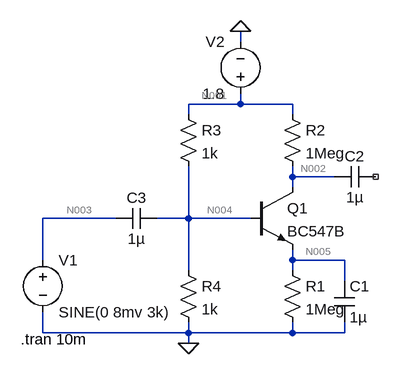
[diagram p0: schematic initial-1-0-1.asc]
initial-1-0-1.asc, the LTspice schematic file:
Version 4
SHEET 1 880 680
WIRE 96 -144 96 -160
WIRE 96 -48 96 -64
WIRE 96 -48 16 -48
WIRE 176 -48 96 -48
WIRE 16 -32 16 -48
WIRE 176 -32 176 -48
WIRE 176 64 176 48
WIRE 240 64 176 64
WIRE 176 80 176 64
WIRE -96 128 -208 128
WIRE 16 128 16 48
WIRE 16 128 -32 128
WIRE 112 128 16 128
WIRE -208 192 -208 128
WIRE 176 192 176 176
WIRE 256 192 176 192
WIRE 16 208 16 128
WIRE 176 208 176 192
WIRE 256 224 256 192
WIRE -208 304 -208 272
WIRE 16 304 16 288
WIRE 16 304 -208 304
WIRE 176 304 176 288
WIRE 176 304 16 304
WIRE 256 304 256 288
WIRE 256 304 176 304
WIRE 16 320 16 304
FLAG 16 320 0
FLAG 96 -160 0
SYMBOL npn 112 80 R0
SYMATTR InstName Q1
SYMATTR Value BC547B
SYMBOL res 160 192 R0
SYMATTR InstName R1
SYMATTR Value 1Meg
SYMBOL res 160 -48 R0
SYMATTR InstName R2
SYMATTR Value 1Meg
SYMBOL res 0 -48 R0
SYMATTR InstName R3
SYMATTR Value 1k
SYMBOL res 0 192 R0
SYMATTR InstName R4
SYMATTR Value 1k
SYMBOL cap 240 224 R0
SYMATTR InstName C1
SYMATTR Value 1µ
SYMBOL cap 304 48 R90
WINDOW 0 0 32 VBottom 2
WINDOW 3 32 32 VTop 2
SYMATTR InstName C2
SYMATTR Value 1µ
SYMBOL cap -32 112 R90
WINDOW 0 0 32 VBottom 2
WINDOW 3 32 32 VTop 2
SYMATTR InstName C3
SYMATTR Value 1µ
SYMBOL voltage -208 176 R0
WINDOW 123 0 0 Left 0
WINDOW 39 0 0 Left 0
SYMATTR InstName V1
SYMATTR Value SINE(0 8mv 3k)
SYMBOL voltage 96 -48 R180
WINDOW 0 24 96 Left 2
WINDOW 3 24 16 Left 2
WINDOW 123 0 0 Left 0
WINDOW 39 0 0 Left 0
SYMATTR InstName V2
SYMATTR Value 1.8
TEXT -242 314 Left 2 !.tran 10m

The netlist it stands for:
* initial-1-0-1.asc
Q1 N002 N004 N005 0 BC547B
R1 N005 0 1Meg
R2 N001 N002 1Meg
R3 N001 N004 1k
R4 N004 0 1k
C1 N005 0 1µ
C2 NC_01 N002 1µ
C3 N004 N003 1µ
V1 N003 0 SINE(0 8mv 3k)
V2 N001 0 1.8
.model NPN NPN
.model PNP PNP
.lib standard.bjt
.tran 10m
.backanno
.end

* Results of the author's LTspice run, read from the files saved beside the schematic
* Operating Point, zero values left out:
*   V(n002) = 1.339 V
*   V(n004) = 900 mV
*   V(n005) = 462.4 mV
*   V(n001) = 1.8 V
*   Ic(Q1) = 460.6 nA
*   Ib(Q1) = 1.789 nA
*   Ie(Q1) = -462.4 nA
*   I(R4) = 900 µA
*   I(R3) = 900 µA
*   I(R2) = 460.6 nA
*   I(R1) = 462.4 nA
*   I(V2) = -900.5 µA
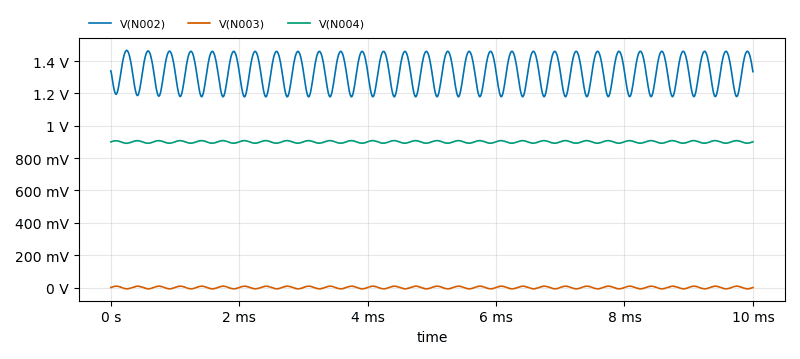
[diagram p1: Transient Analysis of initial-1-0-1.asc, plotted from the saved traces]
* Transient Analysis, 1 run:
*   V(N002): min 1.179 V, max 1.466 V, average 1.33 V, rms 1.334 V, last 1.334 V
*   V(N003): min -8 mV, max 8 mV, average 10.12 nV, rms 5.659 mV, last 0 V
*   V(N004): min 891.6 mV, max 907.9 mV, average 900 mV, rms 900 mV, last 900.8 mV